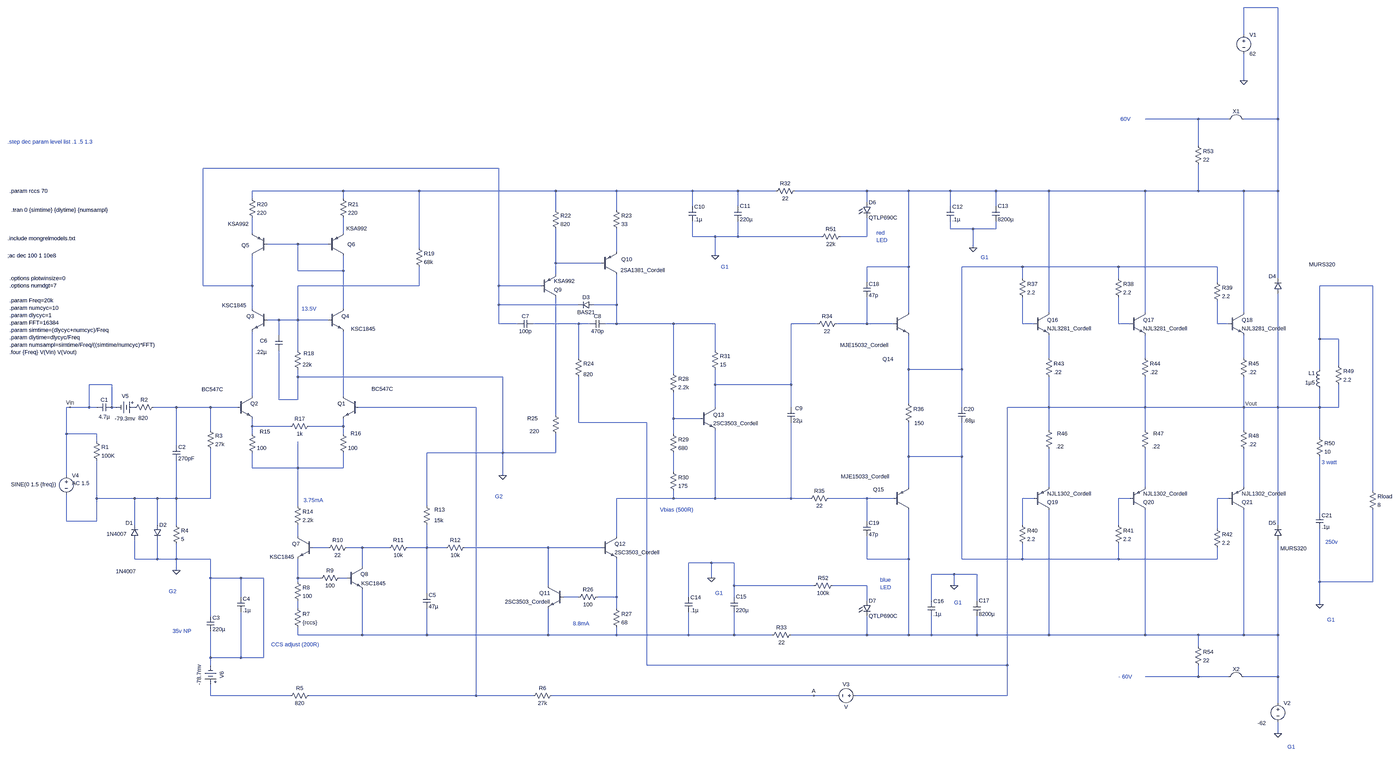
[diagram p0: schematic DIYA-amp-LT-ver 2.4 original.asc, whole sheet]
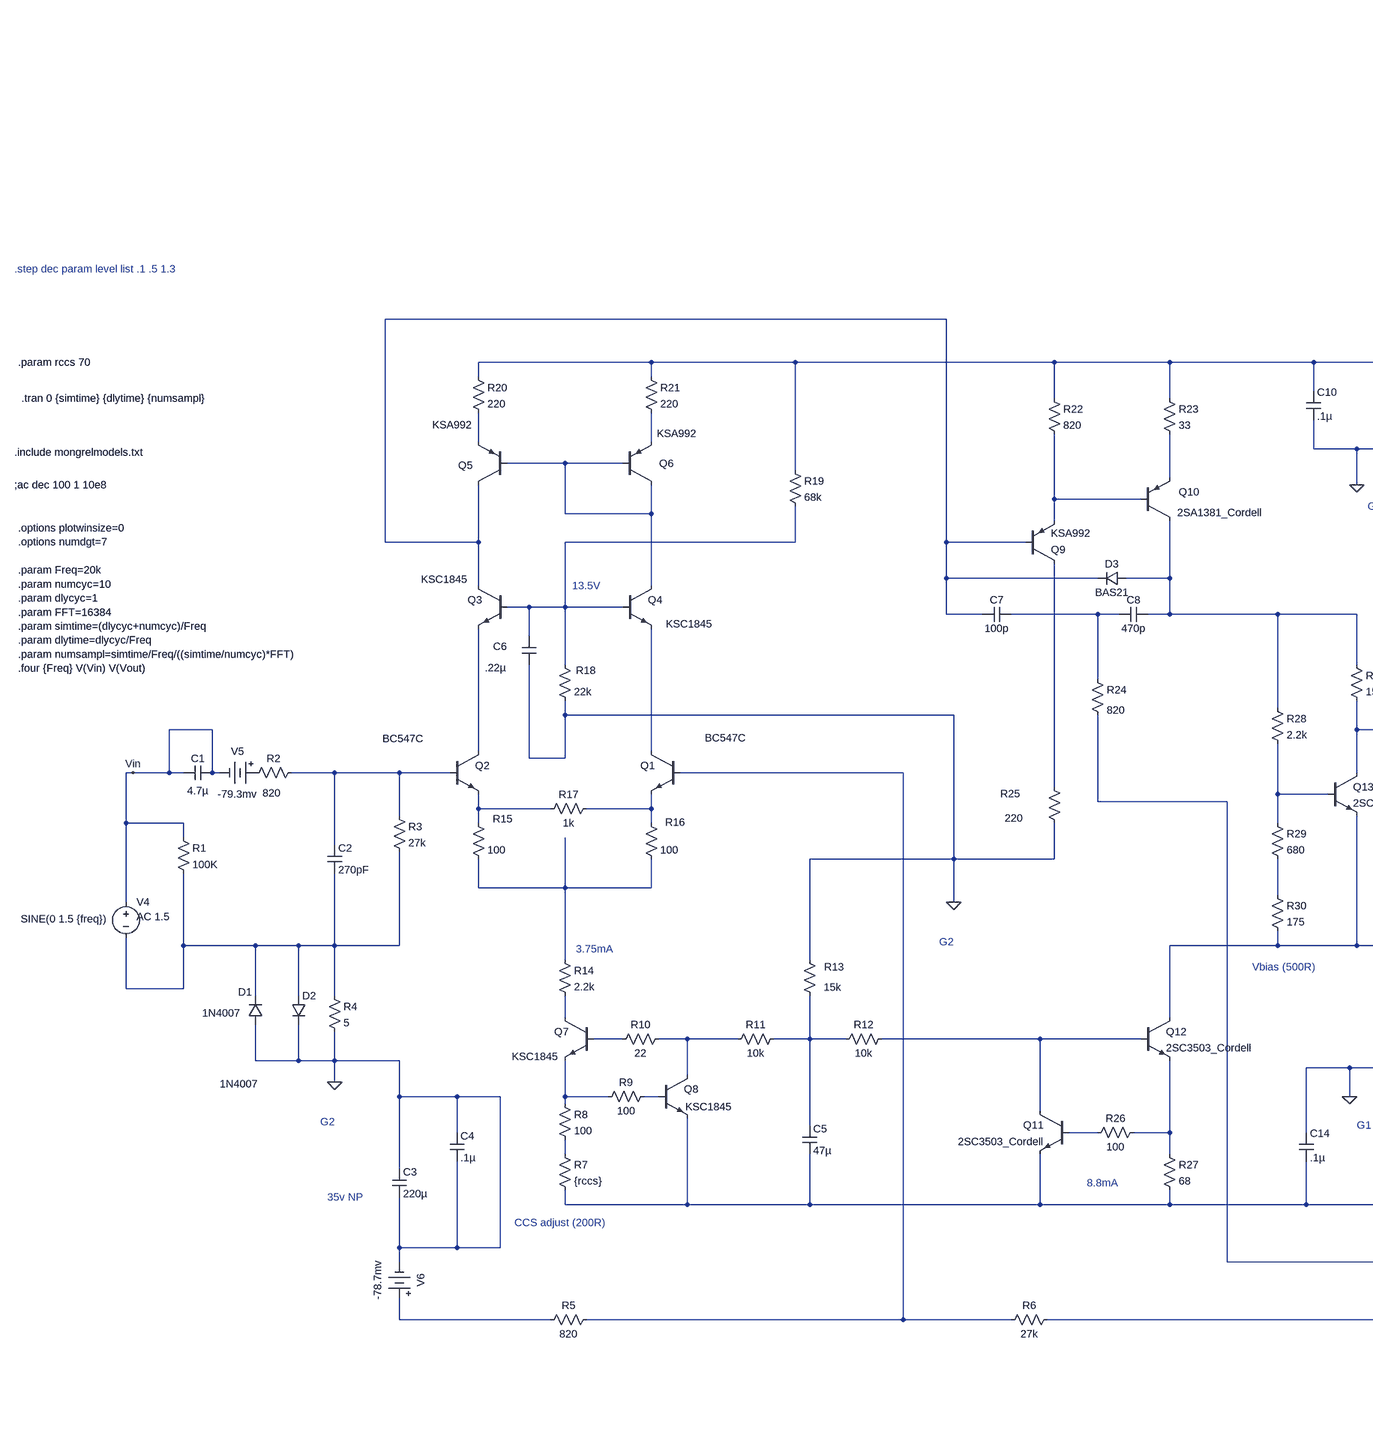
[diagram p1: schematic DIYA-amp-LT-ver 2.4 original.asc, part, row 1 of 1, column 1 of 2]
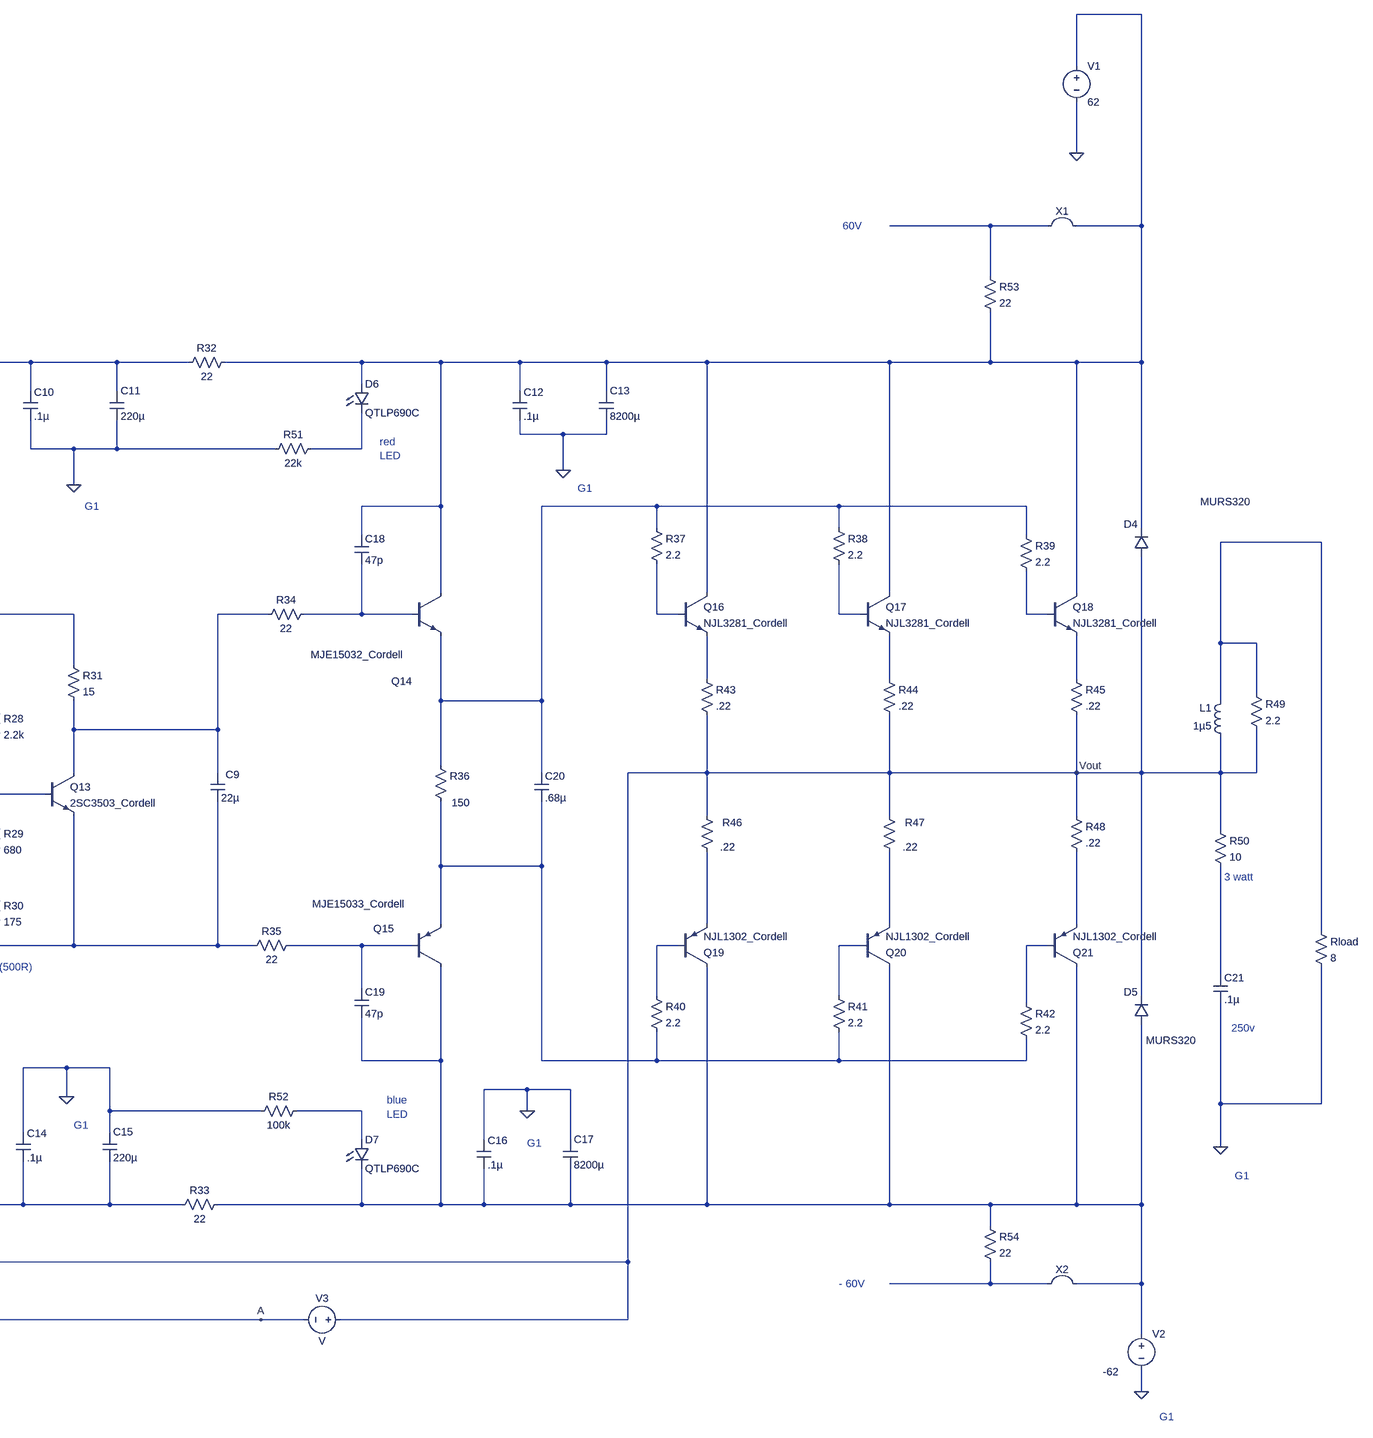
[diagram p2: schematic DIYA-amp-LT-ver 2.4 original.asc, part, row 1 of 1, column 2 of 2]
DIYA-amp-LT-ver 2.4 original.asc, the LTspice schematic file:
Version 4
SHEET 1 5148 21624
WIRE 3904 -1680 3760 -1680
WIRE 3760 -1472 3760 -1680
WIRE 3760 -1248 3760 -1392
WIRE 3568 -512 3344 -512
WIRE 3696 -512 3568 -512
WIRE 3904 -512 3904 -1680
WIRE 3904 -512 3760 -512
WIRE 3568 -400 3568 -512
WIRE 592 -304 -656 -304
WIRE -64 -208 -448 -208
WIRE 256 -208 -64 -208
WIRE 832 -208 256 -208
WIRE 1088 -208 832 -208
WIRE 1408 -208 1088 -208
WIRE 1600 -208 1408 -208
WIRE 1760 -208 1600 -208
WIRE 2144 -208 1840 -208
WIRE 2320 -208 2144 -208
WIRE 2496 -208 2320 -208
WIRE 2688 -208 2496 -208
WIRE 2912 -208 2688 -208
WIRE 3344 -208 2912 -208
WIRE 3568 -208 3568 -320
WIRE 3568 -208 3344 -208
WIRE 3760 -208 3568 -208
WIRE 3904 -208 3904 -512
WIRE 3904 -208 3760 -208
WIRE -448 -176 -448 -208
WIRE -64 -176 -64 -208
WIRE 2144 -160 2144 -208
WIRE 1408 -144 1408 -208
WIRE 1600 -144 1600 -208
WIRE 2496 -144 2496 -208
WIRE 2688 -144 2688 -208
WIRE 832 -128 832 -208
WIRE 1088 -128 1088 -208
WIRE 2496 -48 2496 -80
WIRE 2592 -48 2496 -48
WIRE 2688 -48 2688 -80
WIRE 2688 -48 2592 -48
WIRE -448 -32 -448 -96
WIRE -64 -32 -64 -96
WIRE 1408 -16 1408 -80
WIRE 1504 -16 1408 -16
WIRE 1600 -16 1600 -80
WIRE 1600 -16 1504 -16
WIRE 1952 -16 1600 -16
WIRE 2144 -16 2144 -96
WIRE 2144 -16 2032 -16
WIRE -256 16 -384 16
WIRE -128 16 -256 16
WIRE 256 32 256 -208
WIRE 2592 32 2592 -48
WIRE 1088 48 1088 -48
WIRE 1504 64 1504 -16
WIRE 832 96 832 -48
WIRE 1024 96 832 96
WIRE 2320 112 2320 -208
WIRE 2320 112 2144 112
WIRE 2800 112 2544 112
WIRE 3232 112 2800 112
WIRE 3648 112 3232 112
WIRE -256 128 -256 16
WIRE -64 128 -64 64
WIRE -64 128 -256 128
WIRE 832 144 832 96
WIRE 2800 160 2800 112
WIRE 3232 160 3232 112
WIRE 3904 160 3904 -208
WIRE 2144 176 2144 112
WIRE 3648 176 3648 112
WIRE -656 192 -656 -304
WIRE -448 192 -448 64
WIRE -448 192 -656 192
WIRE 256 192 256 112
WIRE 256 192 -256 192
WIRE 592 192 592 -304
WIRE 768 192 592 192
WIRE 4304 192 4080 192
WIRE 592 272 592 192
WIRE 928 272 592 272
WIRE 1088 272 1088 144
WIRE 1088 272 992 272
WIRE -448 288 -448 192
WIRE -64 288 -64 128
WIRE 2320 304 2320 112
WIRE 2912 304 2912 -208
WIRE 3344 304 3344 -208
WIRE 3760 304 3760 -208
WIRE -336 336 -384 336
WIRE -256 336 -256 192
WIRE -256 336 -336 336
WIRE -128 336 -256 336
WIRE 592 352 592 272
WIRE 672 352 592 352
WIRE 928 352 736 352
WIRE 976 352 928 352
WIRE 1088 352 1088 272
WIRE 1088 352 1040 352
WIRE 1328 352 1088 352
WIRE 1504 352 1328 352
WIRE 1936 352 1824 352
WIRE 2144 352 2144 240
WIRE 2144 352 2016 352
WIRE 2256 352 2144 352
WIRE 2800 352 2800 240
WIRE 2848 352 2800 352
WIRE 3232 352 3232 240
WIRE 3280 352 3232 352
WIRE 3648 352 3648 256
WIRE 3696 352 3648 352
WIRE -336 400 -336 336
WIRE 4080 416 4080 192
WIRE 4160 416 4080 416
WIRE -256 464 -256 336
WIRE 1504 464 1504 352
WIRE 928 496 928 352
WIRE 2912 496 2912 400
WIRE 3344 496 3344 400
WIRE 3760 496 3760 400
WIRE 4160 528 4160 416
WIRE 2320 544 2320 400
WIRE 2544 544 2544 112
WIRE 2544 544 2320 544
WIRE 4080 544 4080 416
WIRE 1328 560 1328 352
WIRE -256 576 -256 544
WIRE 608 576 -256 576
WIRE -1040 608 -1136 608
WIRE 1504 608 1504 544
WIRE 1824 608 1824 352
WIRE 1824 608 1504 608
WIRE -448 656 -448 384
WIRE -64 656 -64 384
WIRE -336 672 -336 464
WIRE -256 672 -256 576
WIRE -256 672 -336 672
WIRE 2320 688 2320 544
WIRE -1216 704 -1232 704
WIRE -1136 704 -1136 608
WIRE -1136 704 -1216 704
WIRE -1104 704 -1136 704
WIRE -1040 704 -1040 608
WIRE -1024 704 -1040 704
WIRE -768 704 -864 704
WIRE -624 704 -768 704
WIRE -512 704 -624 704
WIRE 496 704 0 704
WIRE 1504 704 1504 608
WIRE 1824 704 1824 608
WIRE 2544 704 2544 544
WIRE 2912 704 2912 576
WIRE 2912 704 2736 704
WIRE 3344 704 3344 576
WIRE 3344 704 2912 704
WIRE 3760 704 3760 576
WIRE 3760 704 3344 704
WIRE 3904 704 3904 224
WIRE 3904 704 3760 704
WIRE 4080 704 4080 624
WIRE 4080 704 3904 704
WIRE 4160 704 4160 608
WIRE 4160 704 4080 704
WIRE 832 736 832 240
WIRE 1328 752 1328 640
WIRE 1440 752 1328 752
WIRE 928 768 928 576
WIRE 1216 768 928 768
WIRE -448 784 -448 752
WIRE -288 784 -448 784
WIRE -64 784 -64 752
WIRE -64 784 -208 784
WIRE -624 800 -624 704
WIRE 2912 800 2912 704
WIRE 3344 800 3344 704
WIRE 3760 800 3760 704
WIRE -1232 816 -1232 704
WIRE -1104 816 -1232 816
WIRE -448 816 -448 784
WIRE -64 816 -64 784
WIRE 1328 816 1328 752
WIRE 4080 832 4080 704
WIRE -1104 848 -1104 816
WIRE -768 864 -768 704
WIRE 608 896 608 576
WIRE 608 896 288 896
WIRE 832 896 832 816
WIRE 832 896 608 896
WIRE 2320 912 2320 768
WIRE 2544 912 2544 768
WIRE 2544 912 2320 912
WIRE -448 960 -448 896
WIRE -256 960 -256 848
WIRE -256 960 -448 960
WIRE -64 960 -64 896
WIRE -64 960 -256 960
WIRE 1328 976 1328 896
WIRE -1232 992 -1232 816
WIRE 608 992 608 896
WIRE 2320 1040 2320 912
WIRE 2912 1040 2912 880
WIRE 3344 1040 3344 880
WIRE 3760 1040 3760 880
WIRE 4304 1056 4304 192
WIRE -1104 1088 -1104 928
WIRE -944 1088 -1104 1088
WIRE -848 1088 -944 1088
WIRE -768 1088 -768 928
WIRE -768 1088 -848 1088
WIRE -624 1088 -624 880
WIRE -624 1088 -768 1088
WIRE 1328 1088 1328 1056
WIRE 1328 1088 1088 1088
WIRE 1504 1088 1504 800
WIRE 1504 1088 1328 1088
WIRE 1824 1088 1824 768
WIRE 1824 1088 1504 1088
WIRE 1904 1088 1824 1088
WIRE 2144 1088 1984 1088
WIRE 2256 1088 2144 1088
WIRE 2848 1088 2800 1088
WIRE 3280 1088 3232 1088
WIRE 3696 1088 3648 1088
WIRE -256 1120 -256 960
WIRE 288 1120 288 896
WIRE 4080 1152 4080 912
WIRE -1232 1184 -1232 1072
WIRE -1104 1184 -1104 1088
WIRE -1104 1184 -1232 1184
WIRE 2144 1184 2144 1088
WIRE -944 1200 -944 1088
WIRE -848 1200 -848 1088
WIRE -768 1200 -768 1088
WIRE 2800 1200 2800 1088
WIRE 3232 1200 3232 1088
WIRE 3904 1200 3904 704
WIRE 3648 1216 3648 1088
WIRE -256 1248 -256 1200
WIRE 1088 1248 1088 1088
WIRE -128 1296 -192 1296
WIRE 16 1296 -48 1296
WIRE 128 1296 16 1296
WIRE 288 1296 288 1200
WIRE 288 1296 208 1296
WIRE 368 1296 288 1296
WIRE 800 1296 448 1296
WIRE 1024 1296 800 1296
WIRE -944 1344 -944 1264
WIRE -848 1344 -848 1264
WIRE -848 1344 -944 1344
WIRE -768 1344 -768 1280
WIRE -768 1344 -848 1344
WIRE -624 1344 -768 1344
WIRE 2144 1344 2144 1248
WIRE 2320 1344 2320 1136
WIRE 2320 1344 2144 1344
WIRE 2544 1344 2544 912
WIRE 2800 1344 2800 1280
WIRE 2800 1344 2544 1344
WIRE 3232 1344 3232 1280
WIRE 3232 1344 2800 1344
WIRE 3648 1344 3648 1296
WIRE 3648 1344 3232 1344
WIRE 1488 1360 1392 1360
WIRE 1584 1360 1488 1360
WIRE 16 1376 16 1296
WIRE -768 1392 -768 1344
WIRE 2512 1408 2416 1408
WIRE 2608 1408 2512 1408
WIRE -624 1424 -624 1344
WIRE -496 1424 -624 1424
WIRE -400 1424 -496 1424
WIRE -256 1424 -256 1344
WIRE -160 1424 -256 1424
WIRE -48 1424 -80 1424
WIRE 1488 1424 1488 1360
WIRE -256 1440 -256 1424
WIRE 4080 1440 4080 1216
WIRE 4304 1440 4304 1136
WIRE 4304 1440 4080 1440
WIRE 800 1456 800 1296
WIRE 1584 1456 1584 1360
WIRE 1920 1456 1584 1456
WIRE 2144 1456 2000 1456
WIRE 2512 1456 2512 1408
WIRE 288 1488 288 1296
WIRE -496 1504 -496 1424
WIRE 928 1504 864 1504
WIRE 1088 1504 1088 1344
WIRE 1088 1504 1008 1504
WIRE 1392 1504 1392 1360
WIRE 1584 1504 1584 1456
WIRE 2144 1520 2144 1456
WIRE 2416 1520 2416 1408
WIRE 2608 1520 2608 1408
WIRE 4080 1536 4080 1440
WIRE -256 1552 -256 1520
WIRE 1088 1552 1088 1504
WIRE -624 1584 -624 1424
WIRE -256 1664 -256 1632
WIRE 16 1664 16 1472
WIRE 16 1664 -256 1664
WIRE 288 1664 288 1552
WIRE 288 1664 16 1664
WIRE 800 1664 800 1552
WIRE 800 1664 288 1664
WIRE 1088 1664 1088 1632
WIRE 1088 1664 800 1664
WIRE 1392 1664 1392 1568
WIRE 1392 1664 1088 1664
WIRE 1584 1664 1584 1568
WIRE 1584 1664 1392 1664
WIRE 1744 1664 1584 1664
WIRE 2144 1664 2144 1584
WIRE 2144 1664 1824 1664
WIRE 2320 1664 2320 1344
WIRE 2320 1664 2144 1664
WIRE 2416 1664 2416 1584
WIRE 2416 1664 2320 1664
WIRE 2608 1664 2608 1584
WIRE 2608 1664 2416 1664
WIRE 2912 1664 2912 1136
WIRE 2912 1664 2608 1664
WIRE 3344 1664 3344 1136
WIRE 3344 1664 2912 1664
WIRE 3568 1664 3344 1664
WIRE 3760 1664 3760 1136
WIRE 3760 1664 3568 1664
WIRE 3904 1664 3904 1264
WIRE 3904 1664 3760 1664
WIRE 3568 1712 3568 1664
WIRE -624 1760 -624 1648
WIRE -496 1760 -496 1568
WIRE -496 1760 -624 1760
WIRE -400 1760 -400 1424
WIRE -400 1760 -496 1760
WIRE -624 1792 -624 1760
WIRE 1216 1792 1216 768
WIRE 2736 1792 2736 704
WIRE 2736 1792 1216 1792
WIRE 3568 1840 3568 1792
WIRE 3568 1840 3344 1840
WIRE 3696 1840 3568 1840
WIRE 3904 1840 3904 1664
WIRE 3904 1840 3760 1840
WIRE -624 1920 -624 1872
WIRE -288 1920 -624 1920
WIRE 496 1920 496 704
WIRE 496 1920 -208 1920
WIRE 736 1920 496 1920
WIRE 1920 1920 816 1920
WIRE 2016 1920 1920 1920
WIRE 2736 1920 2736 1792
WIRE 2736 1920 2096 1920
WIRE 3904 1952 3904 1840
WIRE 3904 2080 3904 2032
FLAG -768 1392 0
FLAG 2592 32 0
FLAG 4080 1536 0
FLAG 3904 2080 0
FLAG 3760 704 Vout
FLAG -1216 704 Vin
FLAG 1920 1920 A
FLAG 608 992 0
FLAG 3760 -1248 0
FLAG 2512 1456 0
FLAG 1504 64 0
FLAG 1488 1424 0
SYMBOL res -80 -192 R0
SYMATTR InstName R21
SYMATTR Value 220
SYMBOL res -464 -192 R0
SYMATTR InstName R20
SYMATTR Value 220
SYMBOL res -80 800 R0
WINDOW 0 47 14 Left 2
SYMATTR InstName R16
SYMATTR Value 100
SYMBOL res -464 800 R0
WINDOW 0 47 7 Left 2
SYMATTR InstName R15
SYMATTR Value 100
SYMBOL res -272 1104 R0
SYMATTR InstName R14
SYMATTR Value 2.2k
SYMBOL res -272 1536 R0
SYMATTR InstName R7
SYMATTR Value {rccs}
SYMBOL res -640 784 R0
SYMATTR InstName R3
SYMATTR Value 27k
SYMBOL res -848 688 R90
WINDOW 0 0 56 VBottom 2
WINDOW 3 46 60 VTop 2
SYMATTR InstName R2
SYMATTR Value 820
SYMBOL voltage 3760 -1488 R0
WINDOW 123 24 76 Left 2
WINDOW 39 0 0 Left 2
SYMATTR InstName V1
SYMATTR Value 62
SYMBOL pnp 1024 144 M180
WINDOW 3 81 18 Left 2
WINDOW 0 84 64 Left 2
SYMATTR Value 2SA1381_Cordell
SYMATTR InstName Q10
SYMBOL npn 1024 1248 R0
SYMATTR InstName Q12
SYMATTR Value 2SC3503_Cordell
SYMBOL npn 2256 304 R0
WINDOW 0 -46 197 Left 2
WINDOW 3 -225 138 Left 2
SYMATTR InstName Q14
SYMATTR Value MJE15032_Cordell
SYMBOL res 3744 480 R0
SYMATTR InstName R45
SYMATTR Value .22
SYMBOL res 3744 784 R0
SYMATTR InstName R48
SYMATTR Value .22
SYMBOL res 4064 816 R0
SYMATTR InstName R50
SYMATTR Value 10
SYMBOL res -192 1904 R90
WINDOW 0 0 56 VBottom 2
WINDOW 3 32 56 VTop 2
SYMATTR InstName R5
SYMATTR Value 820
SYMBOL pnp 2256 1136 M180
WINDOW 0 -86 85 Left 2
WINDOW 3 -222 140 Left 2
SYMATTR InstName Q15
SYMATTR Value MJE15033_Cordell
SYMBOL res -784 1184 R0
SYMATTR InstName R4
SYMATTR Value 5
SYMBOL npn -192 1248 M0
WINDOW 3 79 87 Left 2
SYMATTR Value KSC1845
SYMATTR InstName Q7
SYMBOL npn -48 1376 R0
WINDOW 3 60 71 Left 2
SYMATTR Value KSC1845
SYMATTR InstName Q8
SYMBOL res 3632 160 R0
SYMATTR InstName R39
SYMATTR Value 2.2
SYMBOL res 3632 1200 R0
SYMATTR InstName R42
SYMATTR Value 2.2
SYMBOL ind 4096 640 R180
WINDOW 0 36 80 Left 2
WINDOW 3 36 40 Left 2
SYMATTR InstName L1
SYMATTR Value 1µ5
SYMBOL voltage 3904 1936 R0
WINDOW 123 24 76 Left 2
WINDOW 39 0 0 Left 2
WINDOW 3 -86 100 Left 2
SYMATTR Value -62
SYMATTR InstName V2
SYMBOL diode -864 1200 R0
WINDOW 3 -159 196 Left 2
SYMATTR Value 1N4007
SYMATTR InstName D2
SYMBOL diode -928 1264 R180
WINDOW 0 24 72 Left 2
WINDOW 3 50 26 Left 2
SYMATTR InstName D1
SYMATTR Value 1N4007
SYMBOL res 4288 1040 R0
SYMATTR InstName Rload
SYMATTR Value 8
SYMBOL voltage -1232 976 R0
WINDOW 3 -234 53 Left 2
WINDOW 123 24 48 Left 2
WINDOW 39 0 0 Left 2
SYMATTR Value SINE(0 1.5 {freq})
SYMATTR Value2 AC 1.5
SYMATTR InstName V4
SYMBOL cap 4064 1152 R0
SYMATTR InstName C21
SYMATTR Value .1µ
SYMBOL res 4144 512 R0
SYMATTR InstName R49
SYMATTR Value 2.2
SYMBOL res 272 1104 R0
WINDOW 0 48 32 Left 2
WINDOW 3 47 77 Left 2
SYMATTR InstName R13
SYMATTR Value 15k
SYMBOL res -272 1424 R0
SYMATTR InstName R8
SYMATTR Value 100
SYMBOL cap -784 864 R0
SYMATTR InstName C2
SYMATTR Value 270pF
SYMBOL res 832 1904 R90
WINDOW 3 32 56 VTop 2
WINDOW 0 0 56 VBottom 2
SYMATTR Value 27k
SYMATTR InstName R6
SYMBOL cap -640 1584 R0
SYMATTR InstName C3
SYMATTR Value 220µ
SYMBOL cap -1040 688 R90
WINDOW 0 0 32 VBottom 2
WINDOW 3 41 32 VTop 2
SYMATTR InstName C1
SYMATTR Value 4.7µ
SYMBOL cap -512 1504 R0
SYMATTR InstName C4
SYMATTR Value .1µ
SYMBOL pnp -384 64 R180
WINDOW 0 77 43 Left 2
WINDOW 3 79 133 Left 2
SYMATTR InstName Q5
SYMATTR Value KSA992
SYMBOL pnp -128 64 M180
WINDOW 0 81 47 Left 2
WINDOW 3 76 114 Left 2
SYMATTR InstName Q6
SYMATTR Value KSA992
SYMBOL res 1072 -144 R0
SYMATTR InstName R23
SYMATTR Value 33
SYMBOL npn 864 1456 M0
SYMATTR InstName Q11
SYMATTR Value 2SC3503_Cordell
SYMBOL pnp 768 240 M180
SYMATTR InstName Q9
SYMATTR Value KSA992
SYMBOL res 816 -144 R0
SYMATTR InstName R22
SYMATTR Value 820
SYMBOL res 1072 1536 R0
SYMATTR InstName R27
SYMATTR Value 68
SYMBOL res -1120 832 R0
SYMATTR InstName R1
SYMATTR Value 100K
SYMBOL res 816 720 R0
WINDOW 0 -104 31 Left 2
WINDOW 3 -94 85 Left 2
SYMATTR InstName R25
SYMATTR Value 220
SYMBOL res 224 1280 R90
WINDOW 0 0 56 VBottom 2
WINDOW 3 32 56 VTop 2
SYMATTR InstName R11
SYMATTR Value 10k
SYMBOL cap 272 1488 R0
SYMATTR InstName C5
SYMATTR Value 47µ
SYMBOL npn 3696 304 R0
SYMATTR InstName Q18
SYMATTR Value NJL3281_Cordell
SYMBOL pnp 3696 1136 M180
SYMATTR InstName Q21
SYMATTR Value NJL1302_Cordell
SYMBOL cap 1040 336 R90
WINDOW 0 0 32 VBottom 2
WINDOW 3 32 32 VTop 2
SYMATTR InstName C8
SYMATTR Value 470p
SYMBOL res 2896 480 R0
SYMATTR InstName R43
SYMATTR Value .22
SYMBOL res 2896 784 R0
WINDOW 0 50 31 Left 2
WINDOW 3 45 85 Left 2
SYMATTR InstName R46
SYMATTR Value .22
SYMBOL res 2784 144 R0
SYMATTR InstName R37
SYMATTR Value 2.2
SYMBOL res 2784 1184 R0
SYMATTR InstName R40
SYMATTR Value 2.2
SYMBOL npn 2848 304 R0
SYMATTR InstName Q16
SYMATTR Value NJL3281_Cordell
SYMBOL pnp 2848 1136 M180
SYMATTR InstName Q19
SYMATTR Value NJL1302_Cordell
SYMBOL res 464 1280 R90
WINDOW 0 0 56 VBottom 2
WINDOW 3 32 56 VTop 2
SYMATTR InstName R12
SYMATTR Value 10k
SYMBOL res -192 768 R90
WINDOW 0 0 56 VBottom 2
WINDOW 3 32 56 VTop 2
SYMATTR InstName R17
SYMATTR Value 1k
SYMBOL npn 1440 704 R0
SYMATTR InstName Q13
SYMATTR Value 2SC3503_Cordell
SYMBOL res 1312 960 R0
SYMATTR InstName R30
SYMATTR Value 175
SYMBOL res 1312 800 R0
SYMATTR InstName R29
SYMATTR Value 680
SYMBOL res 1312 544 R0
SYMATTR InstName R28
SYMATTR Value 2.2k
SYMBOL cap 1808 704 R0
WINDOW 0 34 4 Left 2
SYMATTR InstName C9
SYMATTR Value 22µ
SYMBOL diode 3920 224 R180
WINDOW 0 24 72 Left 2
WINDOW 3 -226 122 Left 2
SYMATTR InstName D4
SYMATTR Value MURS320
SYMBOL diode 3920 1264 R180
WINDOW 0 24 72 Left 2
WINDOW 3 -105 -35 Left 2
SYMATTR InstName D5
SYMATTR Value MURS320
SYMBOL cap 2480 -144 R0
WINDOW 0 24 2 Left 2
SYMATTR InstName C12
SYMATTR Value .1µ
SYMBOL cap 2672 -144 R0
WINDOW 0 24 -1 Left 2
SYMATTR InstName C13
SYMATTR Value 8200µ
SYMBOL cap 2128 1184 R0
SYMATTR InstName C19
SYMATTR Value 47p
SYMBOL res 2304 672 R0
WINDOW 3 40 99 Left 2
SYMATTR Value 150
SYMATTR InstName R36
SYMBOL cap 2128 176 R0
SYMATTR InstName C18
SYMATTR Value 47p
SYMBOL res 1024 1488 R90
WINDOW 0 0 56 VBottom 2
WINDOW 3 32 56 VTop 2
SYMATTR InstName R26
SYMATTR Value 100
SYMBOL cap 2528 704 R0
SYMATTR InstName C20
SYMATTR Value .68µ
SYMBOL cap 672 368 R270
WINDOW 0 32 32 VTop 2
WINDOW 3 0 32 VBottom 2
SYMATTR InstName C7
SYMATTR Value 100p
SYMBOL res 912 480 R0
WINDOW 3 36 85 Left 2
SYMATTR Value 820
SYMATTR InstName R24
SYMBOL res -64 1408 R90
WINDOW 0 0 56 VBottom 2
WINDOW 3 32 56 VTop 2
SYMATTR InstName R9
SYMATTR Value 100
SYMBOL cap 2400 1520 R0
WINDOW 0 24 2 Left 2
SYMATTR InstName C16
SYMATTR Value .1µ
SYMBOL cap 2592 1520 R0
WINDOW 0 24 -1 Left 2
SYMATTR InstName C17
SYMATTR Value 8200µ
SYMBOL res 1856 -224 R90
WINDOW 0 0 56 VBottom 2
WINDOW 3 32 56 VTop 2
SYMATTR InstName R32
SYMATTR Value 22
SYMBOL res 1840 1648 R90
WINDOW 0 0 56 VBottom 2
WINDOW 3 32 56 VTop 2
SYMATTR InstName R33
SYMATTR Value 22
SYMBOL cap 1392 -144 R0
WINDOW 0 24 2 Left 2
SYMATTR InstName C10
SYMATTR Value .1µ
SYMBOL cap 1584 -144 R0
WINDOW 0 24 -1 Left 2
SYMATTR InstName C11
SYMATTR Value 220µ
SYMBOL cap 1376 1504 R0
WINDOW 0 24 2 Left 2
SYMATTR InstName C14
SYMATTR Value .1µ
SYMBOL cap 1568 1504 R0
WINDOW 0 24 -1 Left 2
SYMATTR InstName C15
SYMATTR Value 220µ
SYMBOL res 1488 448 R0
SYMATTR InstName R31
SYMATTR Value 15
SYMBOL npn -128 288 R0
WINDOW 3 96 85 Left 2
SYMATTR Value KSC1845
SYMATTR InstName Q4
SYMBOL npn -384 288 M0
WINDOW 3 89 -14 Left 2
SYMATTR Value KSC1845
SYMATTR InstName Q3
SYMBOL res -272 448 R0
WINDOW 0 40 29 Left 2
SYMATTR InstName R18
SYMATTR Value 22k
SYMBOL res 240 16 R0
SYMATTR InstName R19
SYMATTR Value 68k
SYMBOL cap -352 400 R0
WINDOW 0 -64 23 Left 2
WINDOW 3 -82 71 Left 2
SYMATTR InstName C6
SYMATTR Value .22µ
SYMBOL npn 0 656 M0
WINDOW 3 -146 -29 Left 2
SYMATTR Value BC547C
SYMATTR InstName Q1
SYMBOL npn -512 656 R0
WINDOW 3 -150 -28 Left 2
SYMATTR Value BC547C
SYMATTR InstName Q2
SYMBOL res 2032 336 R90
WINDOW 0 0 56 VBottom 2
WINDOW 3 32 56 VTop 2
SYMATTR InstName R34
SYMATTR Value 22
SYMBOL res 2000 1072 R90
WINDOW 0 0 56 VBottom 2
WINDOW 3 32 56 VTop 2
SYMATTR InstName R35
SYMATTR Value 22
SYMBOL res -32 1280 R90
WINDOW 0 0 56 VBottom 2
WINDOW 3 32 56 VTop 2
SYMATTR InstName R10
SYMATTR Value 22
SYMBOL LED 2128 -160 R0
SYMATTR InstName D6
SYMATTR Value QTLP690C
SYMATTR Description Diode
SYMATTR Type diode
SYMBOL res 2048 -32 R90
WINDOW 0 0 56 VBottom 2
WINDOW 3 32 56 VTop 2
SYMATTR InstName R51
SYMATTR Value 22k
SYMBOL res 2016 1440 R90
WINDOW 0 0 56 VBottom 2
WINDOW 3 32 56 VTop 2
SYMATTR InstName R52
SYMATTR Value 100k
SYMBOL LED 2128 1520 R0
SYMATTR InstName D7
SYMATTR Value QTLP690C
SYMATTR Description Diode
SYMATTR Type diode
SYMBOL res 3328 480 R0
SYMATTR InstName R44
SYMATTR Value .22
SYMBOL res 3328 784 R0
WINDOW 0 50 31 Left 2
WINDOW 3 45 85 Left 2
SYMATTR InstName R47
SYMATTR Value .22
SYMBOL res 3216 144 R0
SYMATTR InstName R38
SYMATTR Value 2.2
SYMBOL res 3216 1184 R0
SYMATTR InstName R41
SYMATTR Value 2.2
SYMBOL npn 3280 304 R0
SYMATTR InstName Q17
SYMATTR Value NJL3281_Cordell
SYMBOL pnp 3280 1136 M180
SYMATTR InstName Q20
SYMATTR Value NJL1302_Cordell
SYMBOL Misc\\jumper 3728 -576 R0
SYMATTR InstName X1
SYMBOL Misc\\jumper 3728 1776 R0
SYMATTR InstName X2
SYMBOL res 3552 -416 R0
SYMATTR InstName R53
SYMATTR Value 22
SYMBOL res 3552 1696 R0
SYMATTR InstName R54
SYMATTR Value 22
SYMBOL voltage 2112 1920 R90
WINDOW 0 -32 56 VBottom 2
WINDOW 3 32 56 VTop 2
SYMATTR InstName V3
SYMBOL Misc\\battery -928 704 R90
WINDOW 0 -32 56 VBottom 2
WINDOW 3 32 56 VTop 2
WINDOW 123 0 0 Left 2
WINDOW 39 0 0 Left 2
SYMATTR InstName V5
SYMATTR Value -79.3mv
SYMBOL Misc\\battery -624 1888 R180
WINDOW 0 -32 56 VBottom 2
WINDOW 3 32 56 VTop 2
WINDOW 123 0 0 Left 2
WINDOW 39 0 0 Left 2
SYMATTR InstName V6
SYMATTR Value -78.7mv
SYMBOL diode 992 256 R90
WINDOW 0 0 32 VBottom 2
WINDOW 3 32 32 VTop 2
SYMATTR InstName D3
SYMATTR Value BAS21
TEXT -784 1648 Left 2 ;35v NP
TEXT 4088 936 Left 2 ;3 watt
TEXT 4104 1272 Left 2 ;250v
TEXT -232 1096 Left 2 ;3.75mA
TEXT -1472 160 Left 2 !.options plotwinsize=0\n.options numdgt=7\n \n.param Freq=20k\n.param numcyc=10\n.param dlycyc=1\n.param FFT=16384\n.param simtime=(dlycyc+numcyc)/Freq\n.param dlytime=dlycyc/Freq\n.param numsampl=simtime/Freq/((simtime/numcyc)*FFT)\n.four {Freq} V(Vin) V(Vout)
TEXT -1480 -8 Left 2 !.include mongrelmodels.txt
TEXT -1480 64 Left 2 !;ac dec 100 1 10e8
TEXT -1472 -208 Left 2 !.param rccs 70
TEXT -1464 -128 Left 2 !.tran 0 {simtime} {dlytime} {numsampl}
TEXT 1272 1136 Left 2 ;Vbias (500R)
TEXT -368 1704 Left 2 ;CCS adjust (200R)
TEXT -800 1480 Left 2 ;G2
TEXT 576 1080 Left 2 ;G2
TEXT 4112 1600 Left 2 ;G1
TEXT 3944 2136 Left 2 ;G1
TEXT 904 1616 Left 2 ;8.8mA
TEXT -240 288 Left 2 ;13.5V
TEXT -1480 -416 Left 2 ;.step dec param level list .1 .5 1.3
TEXT 2200 1432 Left 2 ;blue\nLED
TEXT 2184 -32 Left 2 ;red\nLED
TEXT 1528 112 Left 2 ;G1
TEXT 2624 72 Left 2 ;G1
TEXT 2512 1528 Left 2 ;G1
TEXT 1504 1488 Left 2 ;G1
TEXT 3240 -512 Left 2 ;60V
TEXT 3232 1840 Left 2 ;- 60V

The netlist it stands for:
* DIYA-amp-LT-ver 2.4 original.asc
R21 N003 N005 220
R20 N003 N004 220
R16 N030 N032 100
R15 N029 N032 100
R14 N032 N044 2.2k
R7 N055 N056 {rccs}
R3 N025 N037 27k
R2 N025 P001 820
V1 N001 0 62
Q10 N013 N009 N008 0 2SA1381_Cordell
Q12 N038 N048 N054 0 2SC3503_Cordell
Q14 N001 N016 N010 0 MJE15032_Cordell
R45 N022 Vout .22
R48 Vout N036 .22
R50 Vout N043 10
R5 N026 N057 820
Q15 N049 N039 N031 0 MJE15033_Cordell
R4 N037 0 5
Q7 N044 N045 N050 0 KSC1845
Q8 N046 N051 N056 0 KSC1845
R39 N010 N019 2.2
R42 N042 N031 2.2
L1 Vout N012 1µ5
V2 N049 0 -62
D2 N037 0 1N4007
D1 0 N037 1N4007
Rload N012 0 8
V4 Vin N037 SINE(0 1.5 {freq}) AC 1.5
C21 N043 0 .1µ
R49 N012 Vout 2.2
R13 0 N047 15k
R8 N050 N055 100
C2 N025 N037 270pF
R6 A N026 27k
C3 0 0 220µ
C1 Vin Vin 4.7µ
C4 0 0 .1µ
Q5 N002 N007 N004 0 KSA992
Q6 N007 N007 N005 0 KSA992
R23 N003 N008 33
Q11 N048 N053 N056 0 2SC3503_Cordell
Q9 N027 N002 N009 0 KSA992
R22 N003 N009 820
R27 N054 N056 68
R1 Vin N037 100K
R25 N027 0 220
R11 N047 N046 10k
C5 N047 N056 47µ
Q18 N001 N019 N022 0 NJL3281_Cordell
Q21 N049 N042 N036 0 NJL1302_Cordell
C8 N013 N014 470p
R43 N020 Vout .22
R46 Vout N034 .22
R37 N010 N017 2.2
R40 N040 N031 2.2
Q16 N001 N017 N020 0 NJL3281_Cordell
Q19 N049 N040 N034 0 NJL1302_Cordell
R12 N048 N047 10k
R17 N030 N029 1k
Q13 N015 N028 N038 0 2SC3503_Cordell
R30 N033 N038 175
R29 N028 N033 680
R28 N013 N028 2.2k
C9 N015 N038 22µ
D4 Vout N001 MURS320
D5 N049 Vout MURS320
C12 N001 0 .1µ
C13 N001 0 8200µ
C19 N039 N049 47p
R36 N010 N031 150
C18 N001 N016 47p
R26 N054 N053 100
C20 N010 N031 .68µ
C7 N002 N014 100p
R24 N014 Vout 820
R9 N051 N050 100
C16 0 N049 .1µ
C17 0 N049 8200µ
R32 N001 N003 22
R33 N049 N056 22
C10 N003 0 .1µ
C11 N003 0 220µ
C14 0 N056 .1µ
C15 0 N056 220µ
R31 N013 N015 15
Q4 N007 N011 N024 0 KSC1845
Q3 N002 N011 N023 0 KSC1845
R18 N011 0 22k
R19 N003 N011 68k
C6 N011 0 .22µ
Q1 N024 N026 N030 0 BC547C
Q2 N023 N025 N029 0 BC547C
R34 N016 N015 22
R35 N039 N038 22
R10 N046 N045 22
D6 N001 N006 QTLP690C
R51 N006 0 22k
R52 N052 0 100k
D7 N052 N049 QTLP690C
R44 N021 Vout .22
R47 Vout N035 .22
R38 N010 N018 2.2
R41 N041 N031 2.2
Q17 N001 N018 N021 0 NJL3281_Cordell
Q20 N049 N041 N035 0 NJL1302_Cordell
R53 N001 N001 22
R54 N049 N049 22
V3 Vout A V
V5 P001 Vin -79.3mv
V6 N057 0 -78.7mv
D3 N013 N002 BAS21
.model D D
.lib standard.dio
.model NPN NPN
.model PNP PNP
.lib standard.bjt
* 35v NP
* 3 watt
* 250v
* 3.75mA
.options plotwinsize=0
.options numdgt=7
.param Freq=20k
.param numcyc=10
.param dlycyc=1
.param FFT=16384
.param simtime=(dlycyc+numcyc)/Freq
.param dlytime=dlycyc/Freq
.param numsampl=simtime/Freq/((simtime/numcyc)*FFT)
.four {Freq} V(Vin) V(Vout)
.include mongrelmodels.txt
;ac dec 100 1 10e8
.param rccs 70
.tran 0 {simtime} {dlytime} {numsampl}
* Vbias (500R)
* CCS adjust (200R)
* G2
* G2
* G1
* G1
* 8.8mA
* 13.5V
* .step dec param level list .1 .5 1.3
* blue
* LED
* red
* LED
* G1
* G1
* G1
* G1
* 60V
* - 60V
.backanno
.end